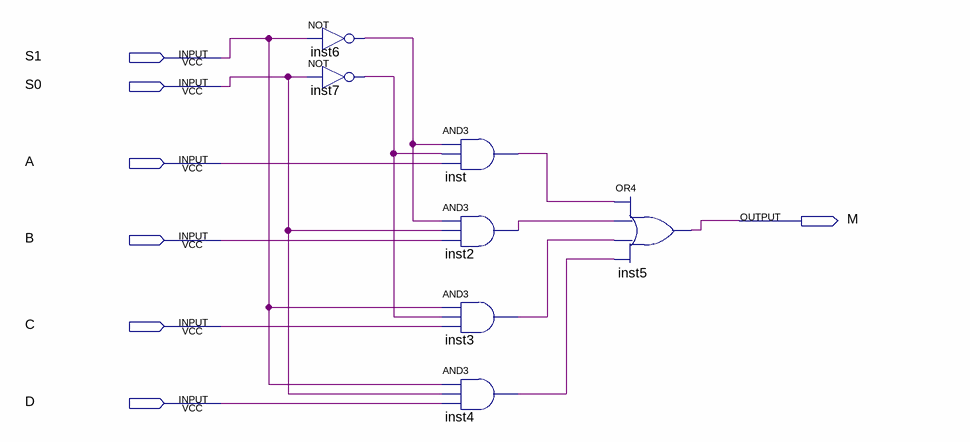
[diagram p0: schematic sheet]
// Quartus schematic MUX_4_1_1BIT.bdf as structural Verilog: 7 symbols, 7 pins
module MUX_4_1_1BIT (
  input  S1,
  input  S0,
  input  A,
  input  B,
  input  C,
  input  D,
  output M
);

  wire inst2_out, inst3_out, inst4_out, inst6_out, inst7_out, inst_out;

  not inst6 (inst6_out, S1);
  not inst7 (inst7_out, S0);
  and inst (inst_out, inst6_out, inst7_out, A);
  and inst2 (inst2_out, inst6_out, S0, B);
  and inst3 (inst3_out, S1, inst7_out, C);
  and inst4 (inst4_out, S1, S0, D);
  or inst5 (M, inst_out, inst2_out, inst3_out, inst4_out);
endmodule
